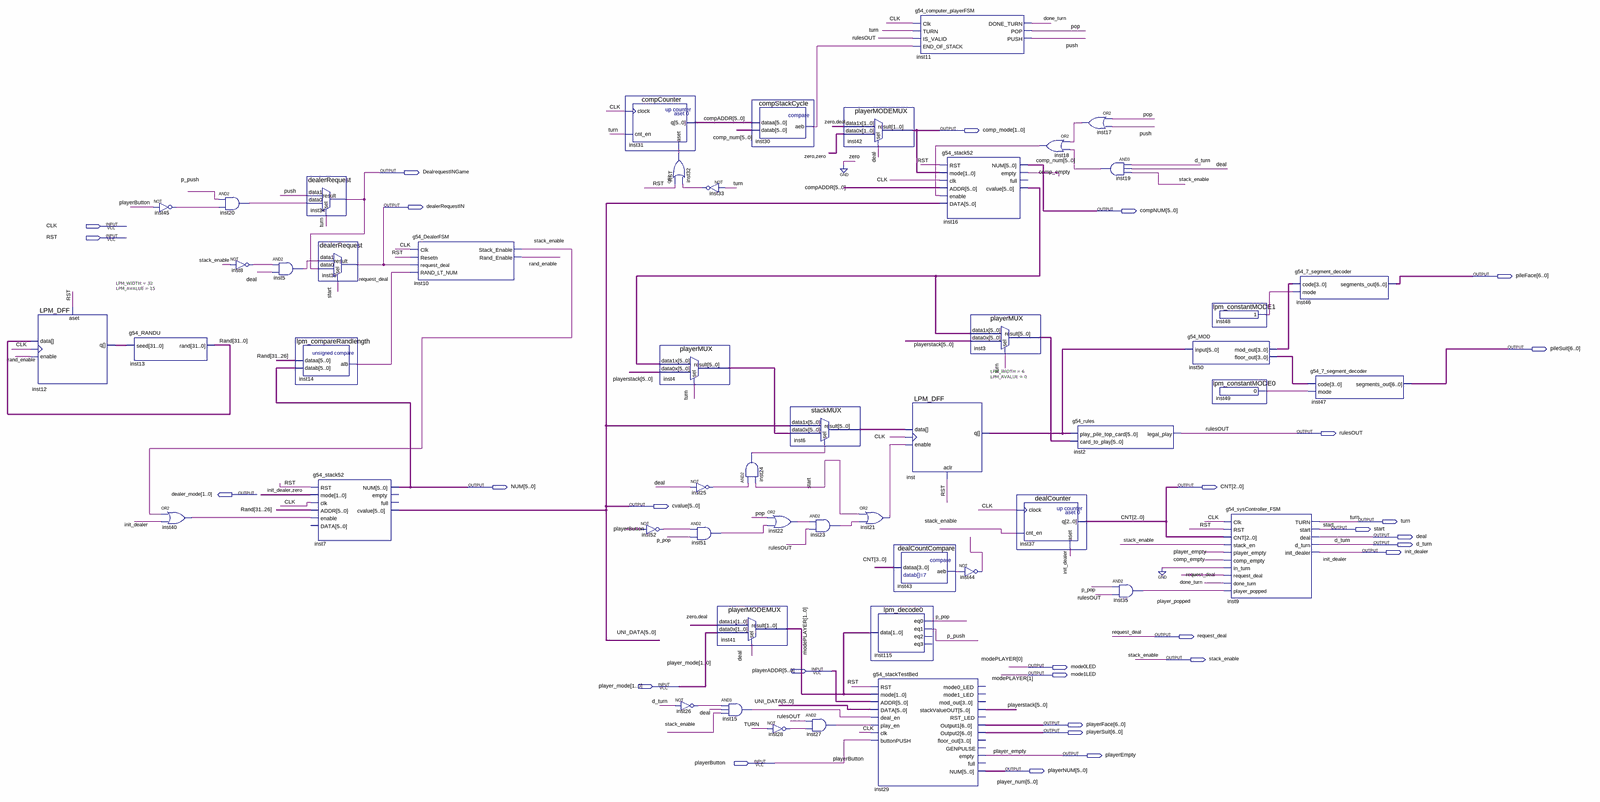
[diagram p0: schematic sheet, whole]
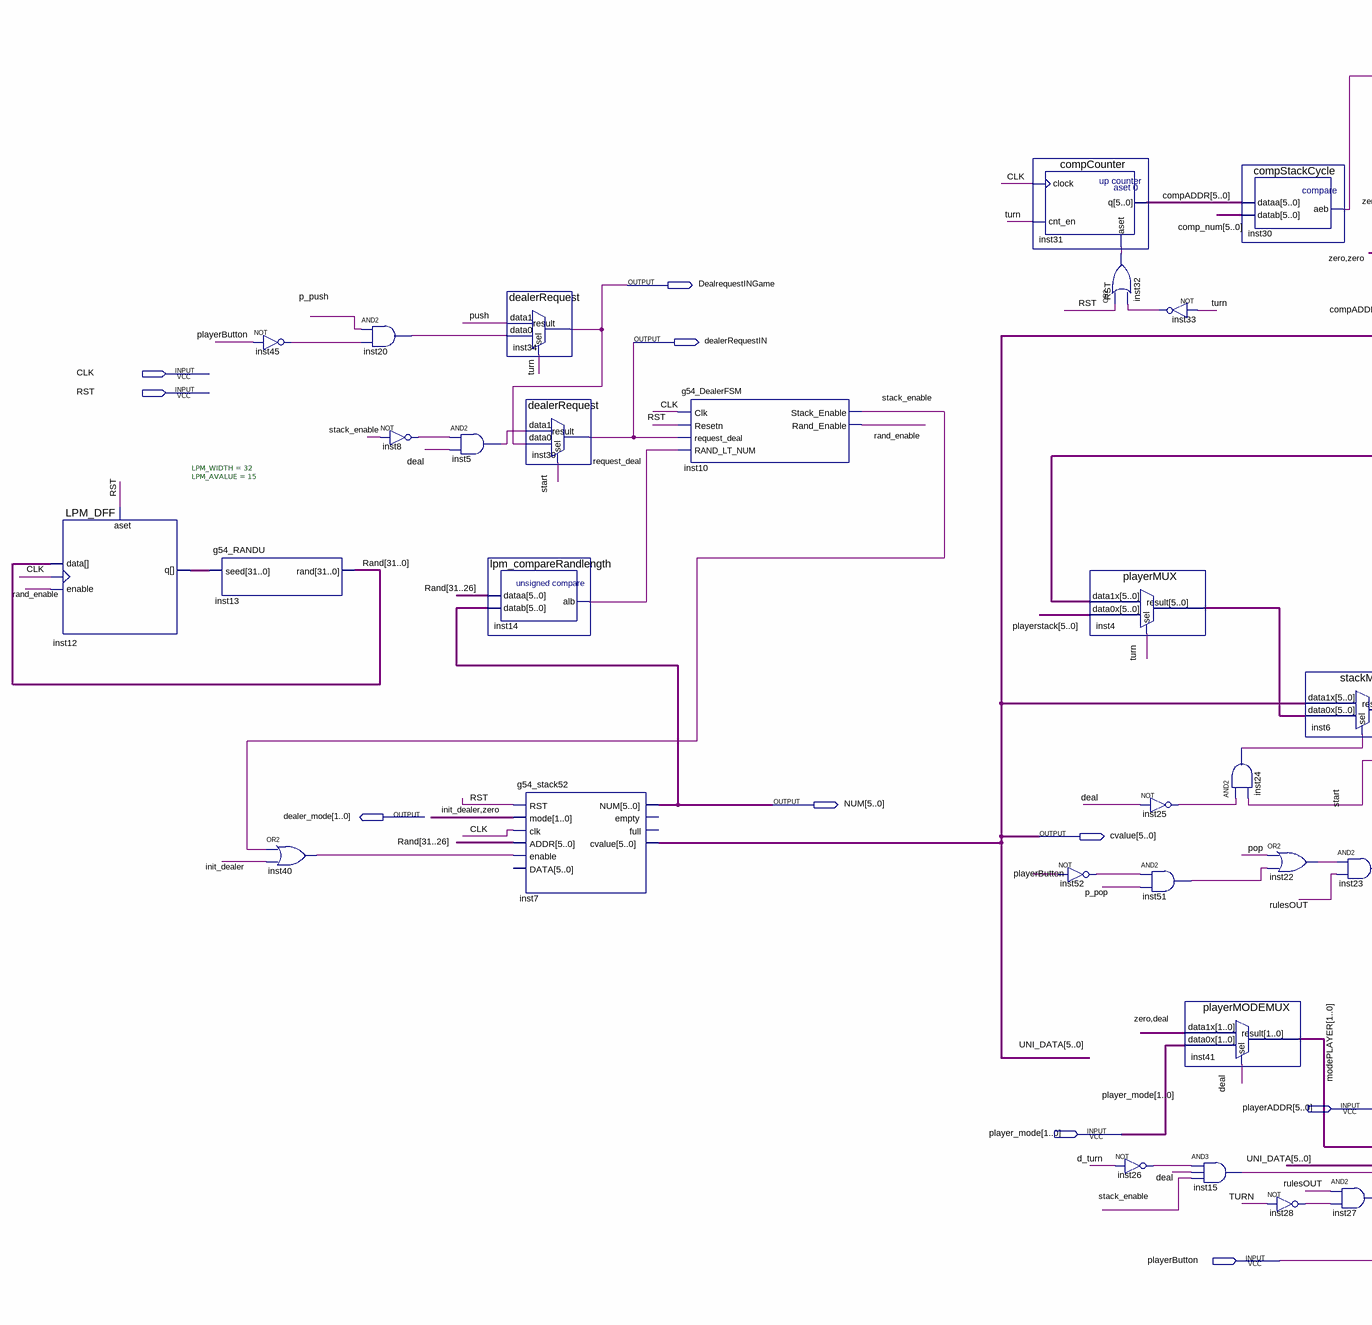
[diagram p1: schematic sheet, left part]
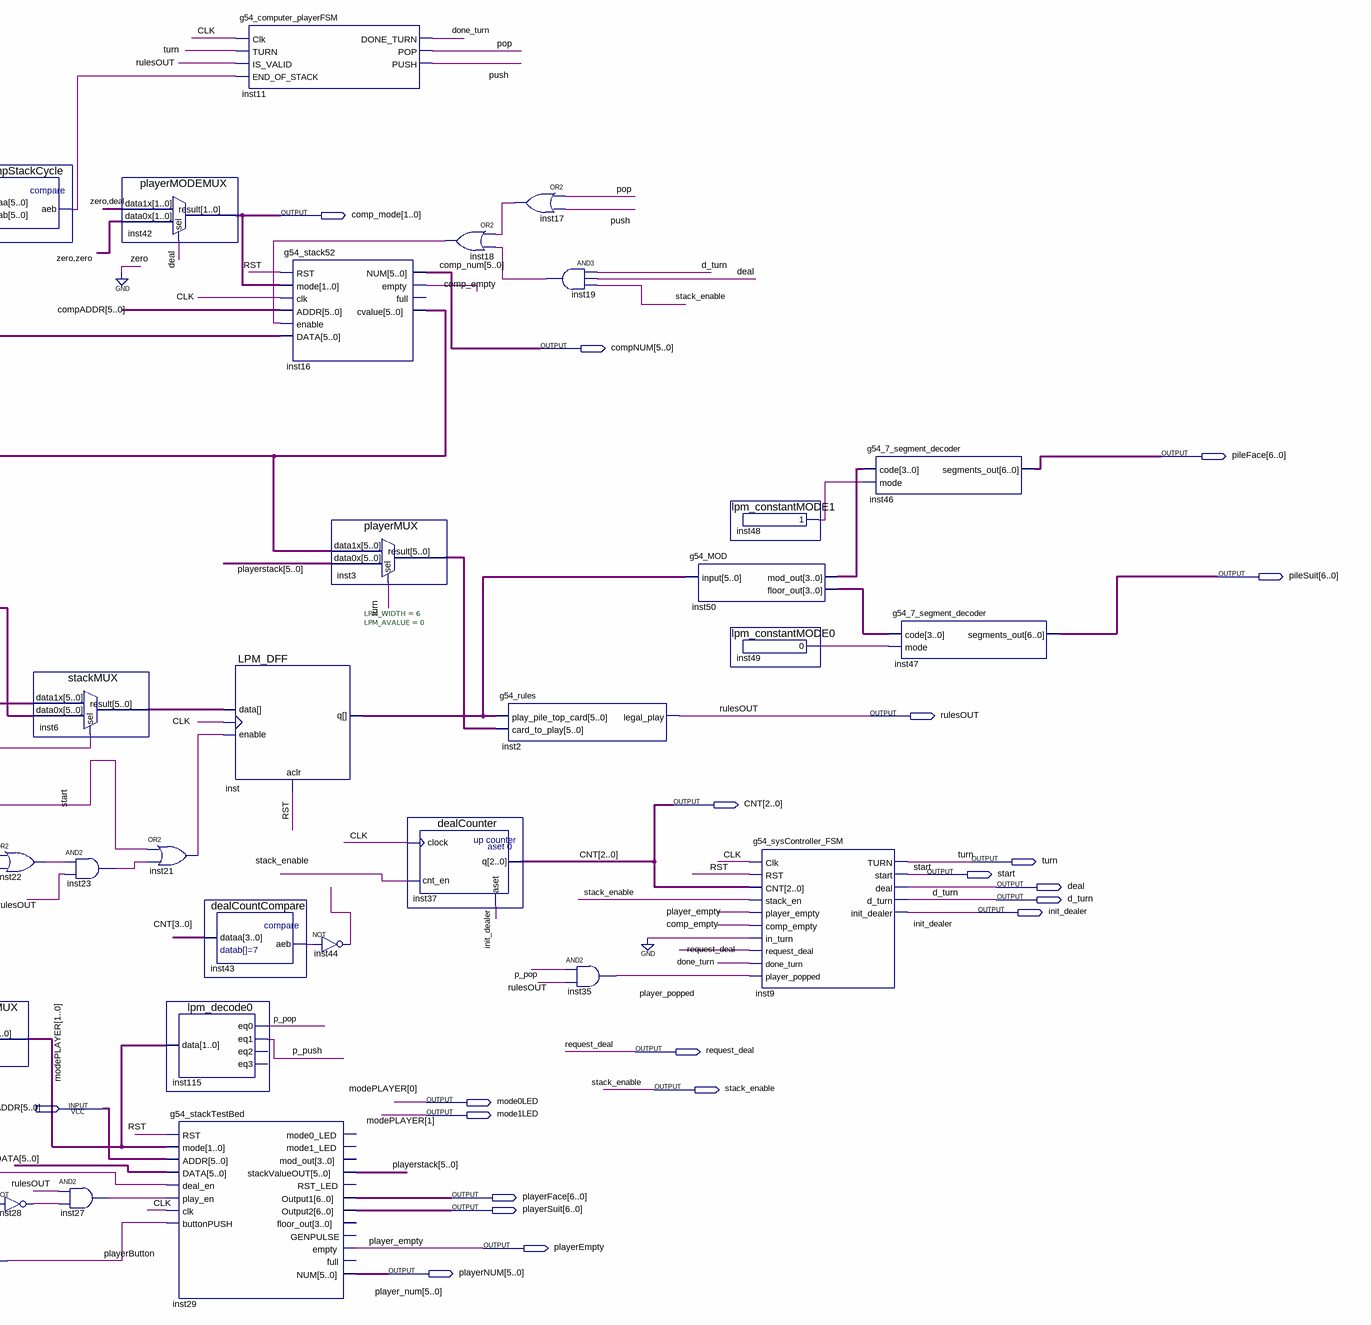
[diagram p2: schematic sheet, right part]
// Quartus schematic g54_fullGameTestbed.bdf as structural Verilog: 51 symbols, 29 pins
module g54_fullGameTestbed (
  input  CLK,
  input  RST,
  input  [5:0] playerADDR,
  input  [1:0] player_mode,
  input  playerButton,
  output [1:0] comp_mode,
  output DealrequestINGame,
  output dealerRequestIN,
  output [5:0] compNUM,
  output [6:0] pileFace,
  output [6:0] pileSuit,
  output rulesOUT,
  output [5:0] NUM,
  output [3:0] CNT,
  output [1:0] dealer_mode,
  output [5:0] cvalue,
  output turn,
  output start,
  output deal,
  output d_turn,
  output init_dealer,
  output request_deal,
  output stack_enable,
  output mode0LED,
  output mode1LED,
  output [6:0] playerFace,
  output [6:0] playerSuit,
  output playerEmpty,
  output [5:0] playerNUM
);

  wire comp_empty, done_turn, inst5_out, inst8_out, inst14_alb, inst15_out, inst17_out, inst18_out,
       inst19_out, inst20_out, inst21_out, inst22_out, inst23_out, inst24_out, inst25_out, inst26_out,
       inst27_out, inst28_out, inst30_aeb, inst32_out, inst33_out, inst40_out, inst43_aeb, inst44_out,
       inst45_out, inst48_result, inst49_result, inst51_out, inst52_out, p_pop, p_push, player_popped, pop,
       push, rand_enable;
  wire [3:0] inst50_floor_out, inst50_mod_out;
  wire [5:0] compADDR, inst3_result, inst4_result, inst6_result, inst16_cvalue, inst_q, playerstack;
  wire [31:0] inst12_q, Rand;

  LPM_DFF #(.LPM_WIDTH(32), .LPM_AVALUE(15)) inst12 (
    .enable(rand_enable), .clock(CLK), .data(Rand), .aset(RST), .q(inst12_q));
  g54_RANDU inst13 (.seed(inst12_q), .\rand (Rand));
  not inst45 (inst45_out, playerButton);
  or inst40 (inst40_out, stack_enable, init_dealer);
  and inst20 (inst20_out, p_push, inst45_out);
  not inst8 (inst8_out, stack_enable);
  and inst5 (inst5_out, inst8_out, deal);
  dealerRequest inst34 (.data1(push), .data0(inst20_out), .sel(turn), .result(DealrequestINGame));
  lpm_compareRandlength inst14 (.dataa(Rand[31:26]), .datab(NUM), .alb(inst14_alb));
  g54_stack52 inst7 (
    .RST(RST), .mode({init_dealer, 1'b0}), .clk(CLK), .ADDR(Rand[31:26]), .enable(inst40_out), .NUM(NUM),
    .cvalue(cvalue));  // open: DATA, empty, full
  dealerRequest inst39 (.data1(inst5_out), .data0(DealrequestINGame), .sel(start), .result(dealerRequestIN));
  g54_DealerFSM inst10 (
    .Clk(CLK), .Resetn(RST), .request_deal(dealerRequestIN), .RAND_LT_NUM(inst14_alb),
    .Stack_Enable(stack_enable), .Rand_Enable(rand_enable));
  compCounter inst31 (.clock(CLK), .cnt_en(turn), .aset(inst32_out), .q(compADDR));
  not inst52 (inst52_out, playerButton);
  or inst32 (inst32_out, RST, inst33_out);
  playerMUX inst4 (.data1x(inst16_cvalue), .data0x(playerstack), .sel(turn), .result(inst4_result));
  not inst26 (inst26_out, d_turn);
  not inst33 (inst33_out, turn);
  not inst25 (inst25_out, deal);
  and inst51 (inst51_out, inst52_out, p_pop);
  and inst24 (inst24_out, inst25_out, start);
  playerMODEMUX inst41 (.data1x({1'b0, deal}), .data0x(player_mode), .sel(deal), .result({mode1LED, mode0LED}));
  and inst15 (inst15_out, inst26_out, deal, stack_enable);
  compStackCycle inst30 (.dataa(compADDR), .datab(compNUM), .aeb(inst30_aeb));
  or inst22 (inst22_out, pop, inst51_out);
  not inst28 (inst28_out, turn);
  stackMUX inst6 (.data1x(cvalue), .data0x(inst4_result), .sel(inst24_out), .result(inst6_result));
  and inst23 (inst23_out, inst22_out, rulesOUT);
  and inst27 (inst27_out, rulesOUT, inst28_out);
  playerMODEMUX inst42 (.data1x({1'b0, deal}), .data0x(2'b00), .sel(deal), .result(comp_mode));
  or inst21 (inst21_out, start, inst23_out);
  dealCountCompare inst43 (.dataa(CNT), .aeb(inst43_aeb));
  lpm_decode0 inst115 (.data({mode1LED, mode0LED}), .eq0(p_pop), .eq1(p_push));  // open: eq2, eq3
  g54_stackTestBed inst29 (
    .RST(RST), .mode({mode1LED, mode0LED}), .ADDR(playerADDR), .DATA(cvalue), .deal_en(inst15_out),
    .play_en(inst27_out), .clk(CLK), .buttonPUSH(playerButton), .stackValueOUT(playerstack),
    .Output1(playerFace), .Output2(playerSuit), .empty(playerEmpty), .NUM(playerNUM));  // open: mode0_LED, mode1_LED, mod_out, RST_LED, floor_out, GENPULSE, full
  g54_computer_playerFSM inst11 (
    .Clk(CLK), .TURN(turn), .IS_VALID(rulesOUT), .END_OF_STACK(inst30_aeb), .DONE_TURN(done_turn), .POP(pop),
    .PUSH(push));
  LPM_DFF #(.LPM_WIDTH(6), .LPM_AVALUE(0)) inst (
    .enable(inst21_out), .clock(CLK), .data(inst6_result), .aclr(RST), .q(inst_q));
  g54_stack52 inst16 (
    .RST(RST), .mode(comp_mode), .clk(CLK), .ADDR(compADDR), .enable(inst18_out), .DATA(cvalue),
    .NUM(compNUM), .empty(comp_empty), .cvalue(inst16_cvalue));  // open: full
  playerMUX inst3 (.data1x(inst16_cvalue), .data0x(playerstack), .sel(turn), .result(inst3_result));
  not inst44 (inst44_out, inst43_aeb);
  dealCounter inst37 (.clock(CLK), .cnt_en(stack_enable), .aset(init_dealer), .q(CNT[2:0]));
  or inst18 (inst18_out, inst17_out, inst19_out);
  g54_rules inst2 (.play_pile_top_card(inst_q), .card_to_play(inst3_result), .legal_play(rulesOUT));
  or inst17 (inst17_out, pop, push);
  and inst19 (inst19_out, d_turn, deal, stack_enable);
  and inst35 (player_popped, p_pop, rulesOUT);
  g54_MOD inst50 (.\input (inst_q), .mod_out(inst50_mod_out), .floor_out(inst50_floor_out));
  lpm_constantMODE1 inst48 (.result(inst48_result));
  lpm_constantMODE0 inst49 (.result(inst49_result));
  g54_sysController_FSM inst9 (
    .Clk(CLK), .RST(RST), .CNT(CNT[2:0]), .stack_en(stack_enable), .player_empty(playerEmpty),
    .comp_empty(comp_empty), .in_turn(1'b0), .request_deal(dealerRequestIN), .done_turn(done_turn),
    .player_popped(player_popped), .TURN(turn), .start(start), .deal(deal), .d_turn(d_turn),
    .init_dealer(init_dealer));
  g54_7_segment_decoder inst46 (.code(inst50_mod_out), .mode(inst48_result), .segments_out(pileFace));
  g54_7_segment_decoder inst47 (.code(inst50_floor_out), .mode(inst49_result), .segments_out(pileSuit));

  assign request_deal = dealerRequestIN;

  // Other names for the same wires on the sheet: comp_num[5:0] = compNUM; modePLAYER[1:0] = {mode1LED, mode0LED};
  //   player_empty = playerEmpty; player_num[5:0] = playerNUM; UNI_DATA[5:0] = cvalue
endmodule
